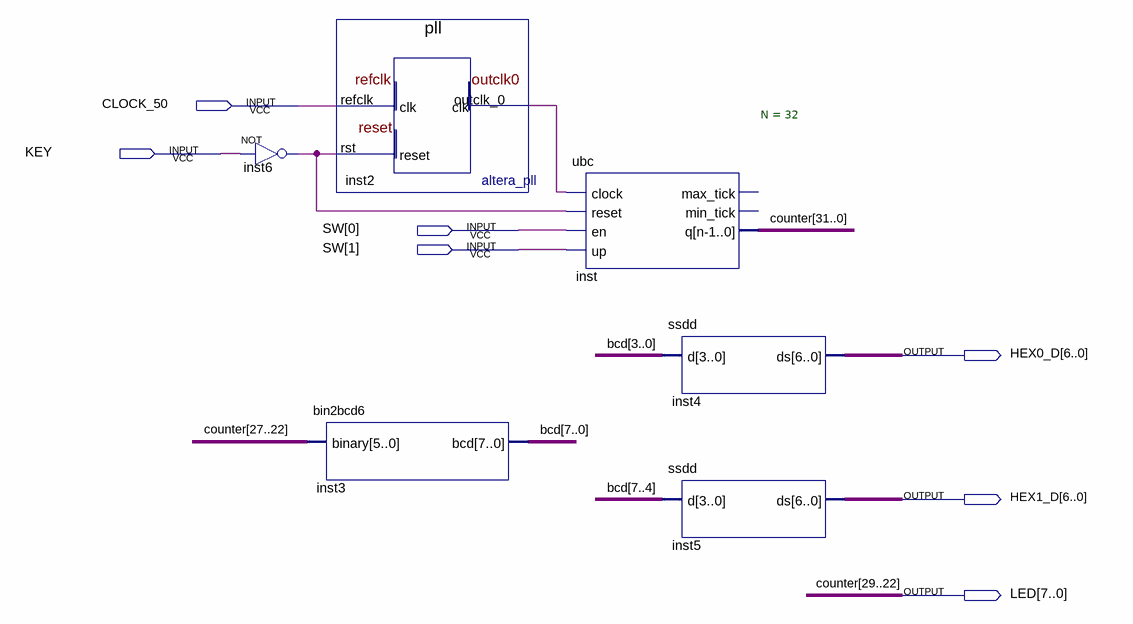
[diagram p0: schematic sheet]
// Quartus schematic lab1.bdf as structural Verilog: 6 symbols, 7 pins
module lab1 (
  input  CLOCK_50,
  input  KEY,
  input  [1:0] SW,
  output [6:0] HEX0_D,
  output [6:0] HEX1_D,
  output [7:0] LED
);

  wire inst2_outclk_0, inst6_out;
  wire [7:0] bcd;
  wire [31:0] counter;

  not inst6 (inst6_out, KEY);
  bin2bcd6 inst3 (.binary(LED[5:0]), .bcd(bcd));
  pll inst2 (.refclk(CLOCK_50), .rst(inst6_out), .outclk_0(inst2_outclk_0));
  ubc #(.N(32)) inst (
    .clock(inst2_outclk_0), .reset(inst6_out), .en(SW[0]), .up(SW[1]),
    .q({counter[31:30], LED, counter[21:0]}));  // open: max_tick, min_tick
  ssdd inst4 (.d(bcd[3:0]), .ds(HEX0_D));
  ssdd inst5 (.d(bcd[7:4]), .ds(HEX1_D));

  // Other names for the same wires on the sheet: counter[29:22] = LED
endmodule
